# EAGLE design BESt-module_v.1.2_big (EAGLE 9.6.2)

## Sheet 1 of 2
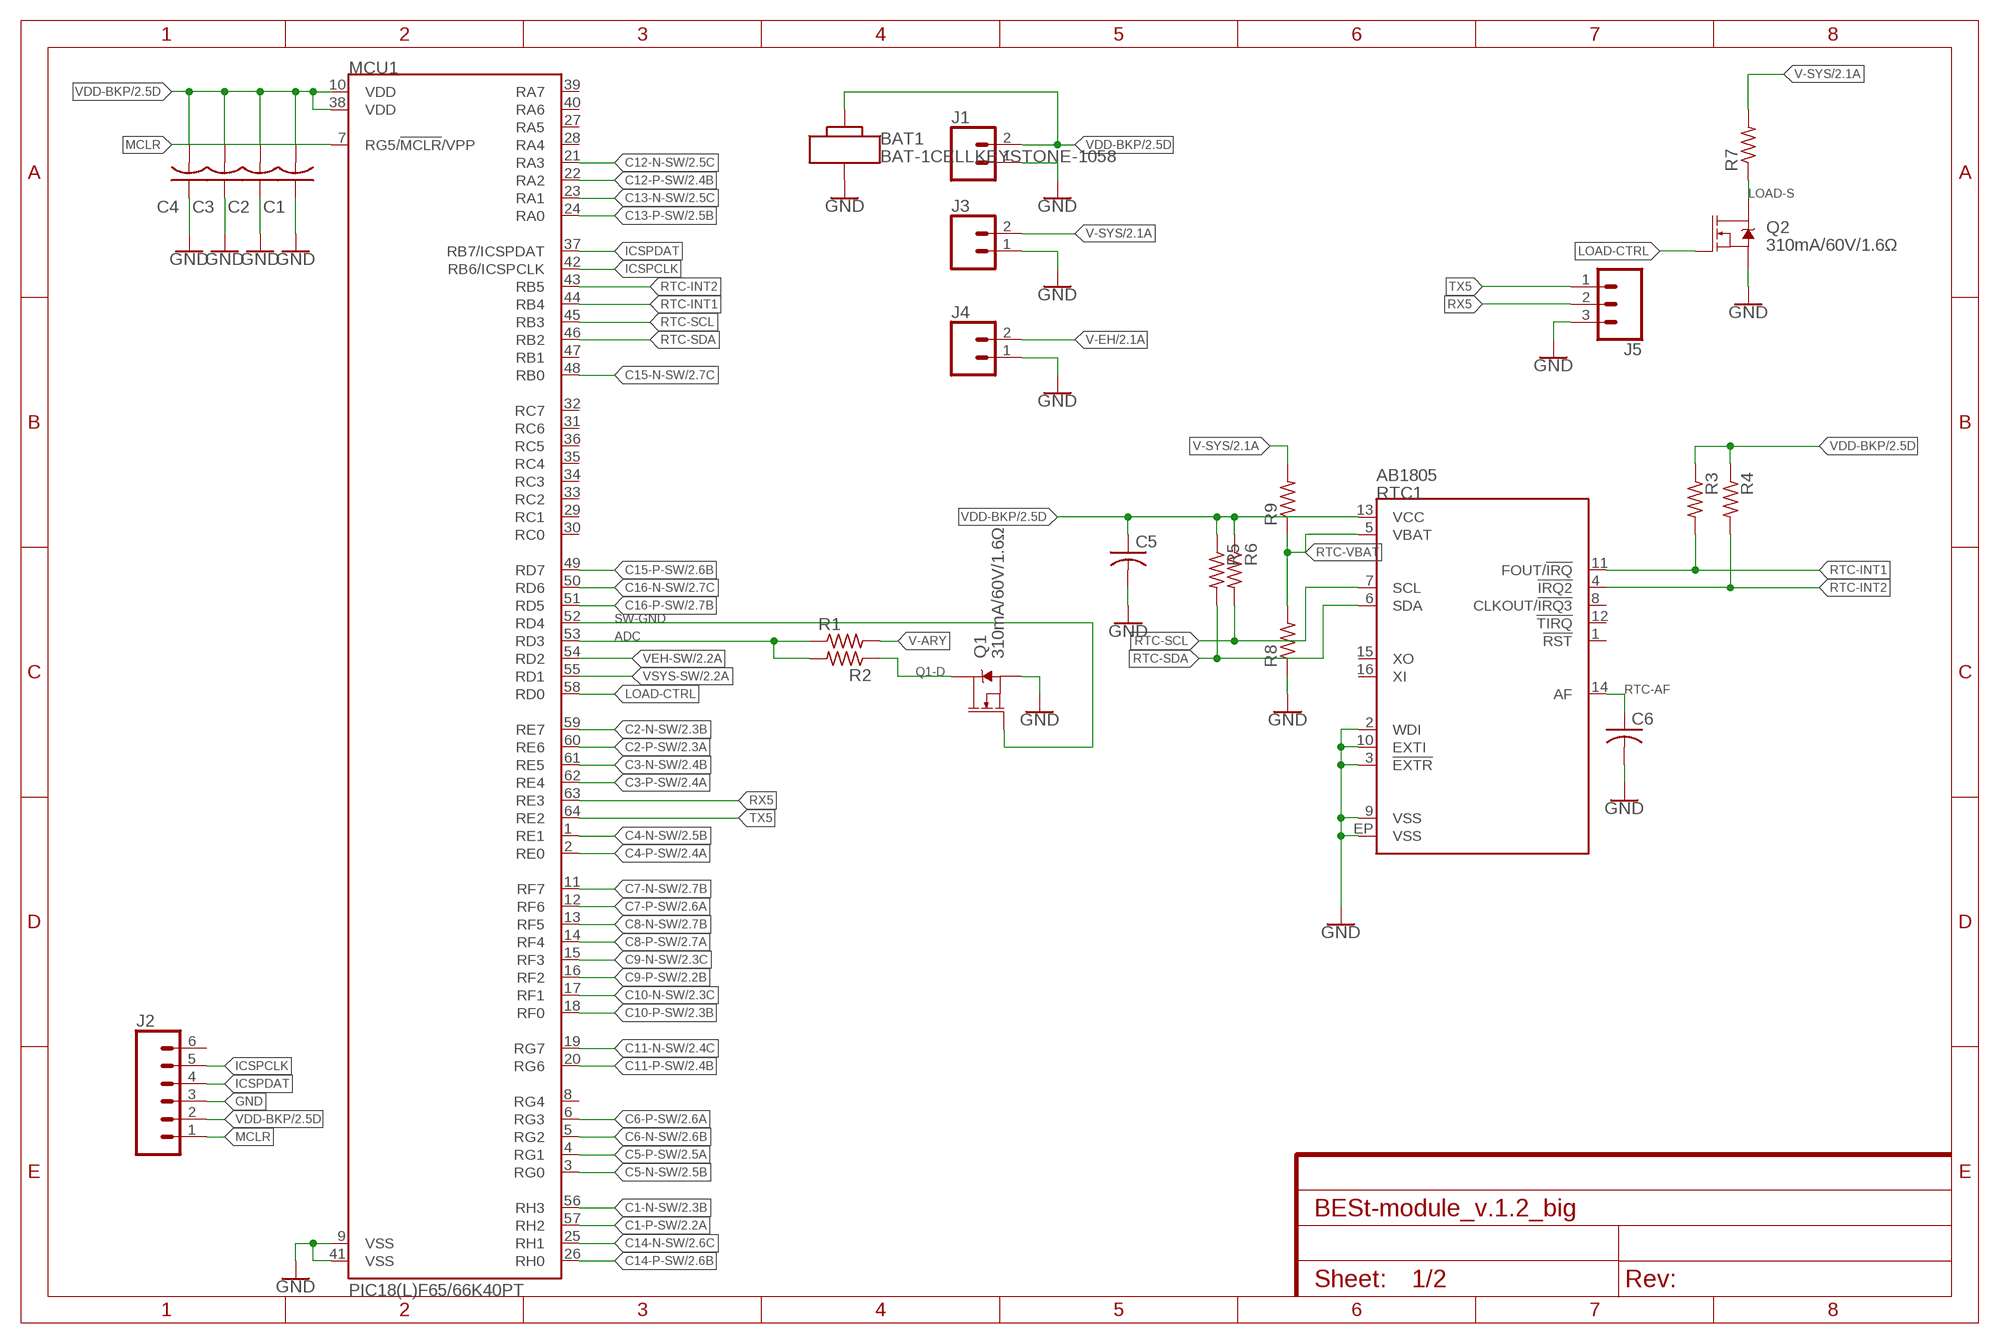
[diagram p0: schematic, sheet 1]

### Parts
BAT1  BAT-1CELLKEYSTONE-1058  [KEYSTONE-1058]
C1  0.1uF  C-USC0603  [C0603]
C2  0.1uF  C-USC0603  [C0603]
C3  0.1uF  C-USC0603  [C0603]
C4  0.1uF  C-USC0603  [C0603]
C5  C-USC0603  [C0603]
C6  C-USC0603  [C0603]
J1  CONN_02  [1X02]
J2  CONN_06NO_SILK_NO_POP  [1X06_NO_SILK]
J3  CONN_025MM  [SCREWTERMINAL-5MM-2]
J4  CONN_025MM  [SCREWTERMINAL-5MM-2]
J5  CONN_03  [1X03]
MCU1  PIC18(L)F65/66K40PT  [QFP50P1200X1200X120-64N]
Q1  310mA/60V/1.6Ω  MOSFET-NCH-2N7002PW  [SOT323]
Q2  310mA/60V/1.6Ω  MOSFET-NCH-2N7002PW  [SOT323]
R1  R-US_R0603  [R0603]
R2  R-US_R0603  [R0603]
R3  R-US_R0603  [R0603]
R4  R-US_R0603  [R0603]
R5  R-US_R0603  [R0603]
R6  R-US_R0603  [R0603]
R7  R-US_R0805  [R0805]
R8  R-US_R0603  [R0603]
R9  R-US_R0603  [R0603]
RTC1  AB1805  [QFN-16-3X3]

### Nets
ADC: MCU1.53(RD3) R1.1 R2.2
C1-N-SW: MCU1.56(RH3) ; also sheet 2
C1-P-SW: MCU1.57(RH2) ; also sheet 2
C2-N-SW: MCU1.59(RE7) ; also sheet 2
C2-P-SW: MCU1.60(RE6) ; also sheet 2
C3-N-SW: MCU1.61(RE5) ; also sheet 2
C3-P-SW: MCU1.62(RE4) ; also sheet 2
C4-N-SW: MCU1.1(RE1) ; also sheet 2
C4-P-SW: MCU1.2(RE0) ; also sheet 2
C5-N-SW: MCU1.3(RG0) ; also sheet 2
C5-P-SW: MCU1.4(RG1) ; also sheet 2
C6-N-SW: MCU1.5(RG2) ; also sheet 2
C6-P-SW: MCU1.6(RG3) ; also sheet 2
C7-N-SW: MCU1.11(RF7) ; also sheet 2
C7-P-SW: MCU1.12(RF6) ; also sheet 2
C8-N-SW: MCU1.13(RF5) ; also sheet 2
C8-P-SW: MCU1.14(RF4) ; also sheet 2
C9-N-SW: MCU1.15(RF3) ; also sheet 2
C9-P-SW: MCU1.16(RF2) ; also sheet 2
C10-N-SW: MCU1.17(RF1) ; also sheet 2
C10-P-SW: MCU1.18(RF0) ; also sheet 2
C11-N-SW: MCU1.19(RG7) ; also sheet 2
C11-P-SW: MCU1.20(RG6) ; also sheet 2
C12-N-SW: MCU1.21(RA3) ; also sheet 2
C12-P-SW: MCU1.22(RA2) ; also sheet 2
C13-N-SW: MCU1.23(RA1) ; also sheet 2
C13-P-SW: MCU1.24(RA0) ; also sheet 2
C14-N-SW: MCU1.25(RH1) ; also sheet 2
C14-P-SW: MCU1.26(RH0) ; also sheet 2
C15-N-SW: MCU1.48(RB0) ; also sheet 2
C15-P-SW: MCU1.49(RD7) ; also sheet 2
C16-N-SW: MCU1.50(RD6) ; also sheet 2
C16-P-SW: MCU1.51(RD5) ; also sheet 2
GND: BAT1.N C1.1 C2.1 C3.1 C4.1 C5.2 C6.2 J1.1 J2.3 J3.1 J4.1 J5.3 MCU1.9(VSS) MCU1.41(VSS) Q1.2(S) Q2.2(S) R8.1 RTC1.2(WDI) RTC1.3(!EXTR) RTC1.9(VSS) RTC1.10(EXTI) RTC1.EP(VSS) ; also sheet 2
ICSPCLK: J2.5 MCU1.42(RB6/ICSPCLK)
ICSPDAT: J2.4 MCU1.37(RB7/ICSPDAT)
LOAD-CTRL: MCU1.58(RD0) Q2.1(G)
LOAD-S: Q2.3(D) R7.1
MCLR: J2.1 MCU1.7(RG5/!MCLR!/VPP)
Q1-D: Q1.3(D) R2.1
RTC-AF: C6.1 RTC1.14(AF)
RTC-INT1: MCU1.44(RB4) R3.2 RTC1.11(FOUT/!IRQ)
RTC-INT2: MCU1.43(RB5) R4.2 RTC1.4(!IRQ2)
RTC-SCL: MCU1.45(RB3) R6.2 RTC1.7(SCL)
RTC-SDA: MCU1.46(RB2) R5.2 RTC1.6(SDA)
RTC-VBAT: R8.2 R9.1 RTC1.5(VBAT)
RX5: J5.2 MCU1.63(RE3)
SW-GND: MCU1.52(RD4) Q1.1(G)
TX5: J5.1 MCU1.64(RE2)
V-ARY: R1.2 ; also sheet 2
V-EH: J4.2 ; also sheet 2
V-SYS: J3.2 R7.2 R9.2 ; also sheet 2
VDD-BKP: BAT1.P C1.2 C2.2 C3.2 C4.2 C5.1 J1.2 J2.2 MCU1.10(VDD) MCU1.38(VDD) R3.1 R4.1 R5.1 R6.1 RTC1.13(VCC) ; also sheet 2
VEH-SW: MCU1.54(RD2) ; also sheet 2
VSYS-SW: MCU1.55(RD1) ; also sheet 2
Unconnected: J2.6 MCU1.8(RG4) MCU1.27(RA5) MCU1.28(RA4) MCU1.29(RC1) MCU1.30(RC0) MCU1.31(RC6) MCU1.32(RC7) MCU1.33(RC2) MCU1.34(RC3) MCU1.35(RC4) MCU1.36(RC5) MCU1.39(RA7) MCU1.40(RA6) MCU1.47(RB1) RTC1.1(!RST) RTC1.8(CLKOUT/!IRQ3) RTC1.12(!TIRQ) RTC1.15(XO) RTC1.16(XI)

## Sheet 2 of 2
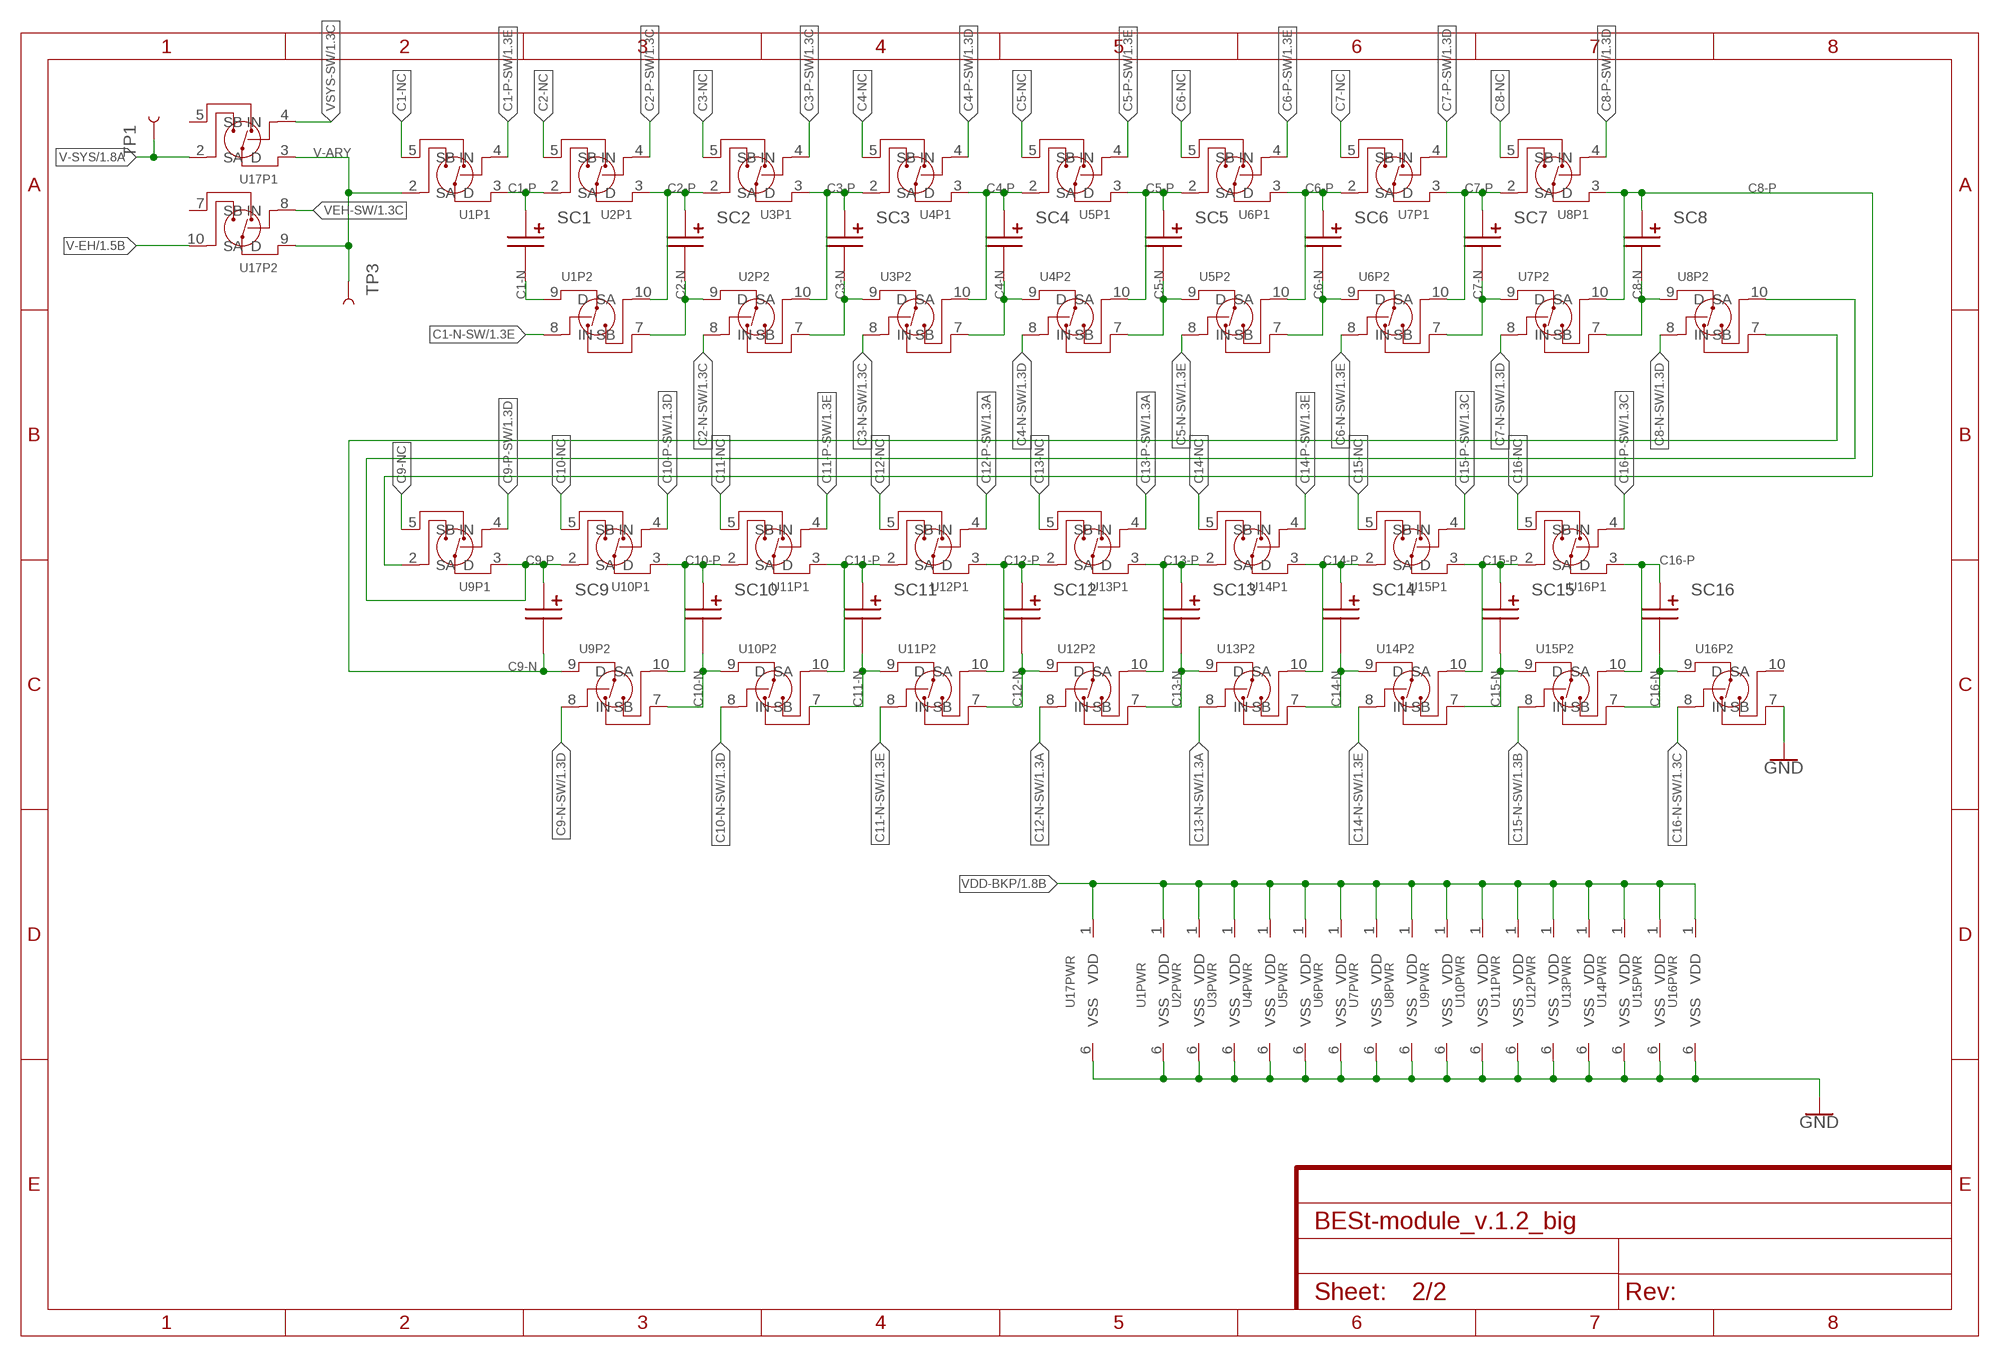
[diagram p1: schematic, sheet 2]

### Parts
SC1  PM-5R0H/V104-R-VER  [EATON-13X11.3X6-V]
SC2  PM-5R0H/V104-R-VER  [EATON-13X11.3X6-V]
SC3  PM-5R0H/V104-R-VER  [EATON-13X11.3X6-V]
SC4  PM-5R0H/V104-R-VER  [EATON-13X11.3X6-V]
SC5  PM-5R0H/V104-R-VER  [EATON-13X11.3X6-V]
SC6  PM-5R0H/V104-R-VER  [EATON-13X11.3X6-V]
SC7  PM-5R0H/V104-R-VER  [EATON-13X11.3X6-V]
SC8  PM-5R0H/V104-R-VER  [EATON-13X11.3X6-V]
SC9  PM-5R0H/V104-R-VER  [EATON-13X11.3X6-V]
SC10  PM-5R0H/V104-R-VER  [EATON-13X11.3X6-V]
SC11  PM-5R0H/V104-R-VER  [EATON-13X11.3X6-V]
SC12  PM-5R0H/V104-R-VER  [EATON-13X11.3X6-V]
SC13  PM-5R0H/V104-R-VER  [EATON-13X11.3X6-V]
SC14  PM-5R0H/V104-R-VER  [EATON-13X11.3X6-V]
SC15  PM-5R0H/V104-R-VER  [EATON-13X11.3X6-V]
SC16  PM-5R0H/V104-R-VER  [EATON-13X11.3X6-V]
TP1  TEST-POINT3X4  [PAD.03X.04]
TP3  TEST-POINT3X4  [PAD.03X.04]
U1  DG2535EDQ  [SOP50P490X110-10N]
U2  DG2535EDQ  [SOP50P490X110-10N]
U3  DG2535EDQ  [SOP50P490X110-10N]
U4  DG2535EDQ  [SOP50P490X110-10N]
U5  DG2535EDQ  [SOP50P490X110-10N]
U6  DG2535EDQ  [SOP50P490X110-10N]
U7  DG2535EDQ  [SOP50P490X110-10N]
U8  DG2535EDQ  [SOP50P490X110-10N]
U9  DG2535EDQ  [SOP50P490X110-10N]
U10  DG2535EDQ  [SOP50P490X110-10N]
U11  DG2535EDQ  [SOP50P490X110-10N]
U12  DG2535EDQ  [SOP50P490X110-10N]
U13  DG2535EDQ  [SOP50P490X110-10N]
U14  DG2535EDQ  [SOP50P490X110-10N]
U15  DG2535EDQ  [SOP50P490X110-10N]
U16  DG2535EDQ  [SOP50P490X110-10N]
U17  DG2535EDQ  [SOP50P490X110-10N]

### Nets
C1-N: SC1.N U1.9(P2:D)
C1-N-SW: U1.8(P2:IN) ; also sheet 1
C1-NC: U1.5(P1:SB)
C1-P: SC1.P U1.3(P1:D) U2.2(P1:SA)
C1-P-SW: U1.4(P1:IN) ; also sheet 1
C2-N: SC2.N U1.7(P2:SB) U2.9(P2:D)
C2-N-SW: U2.8(P2:IN) ; also sheet 1
C2-NC: U2.5(P1:SB)
C2-P: SC2.P U1.10(P2:SA) U2.3(P1:D) U3.2(P1:SA)
C2-P-SW: U2.4(P1:IN) ; also sheet 1
C3-N: SC3.N U2.7(P2:SB) U3.9(P2:D)
C3-N-SW: U3.8(P2:IN) ; also sheet 1
C3-NC: U3.5(P1:SB)
C3-P: SC3.P U2.10(P2:SA) U3.3(P1:D) U4.2(P1:SA)
C3-P-SW: U3.4(P1:IN) ; also sheet 1
C4-N: SC4.N U3.7(P2:SB) U4.9(P2:D)
C4-N-SW: U4.8(P2:IN) ; also sheet 1
C4-NC: U4.5(P1:SB)
C4-P: SC4.P U3.10(P2:SA) U4.3(P1:D) U5.2(P1:SA)
C4-P-SW: U4.4(P1:IN) ; also sheet 1
C5-N: SC5.N U4.7(P2:SB) U5.9(P2:D)
C5-N-SW: U5.8(P2:IN) ; also sheet 1
C5-NC: U5.5(P1:SB)
C5-P: SC5.P U4.10(P2:SA) U5.3(P1:D) U6.2(P1:SA)
C5-P-SW: U5.4(P1:IN) ; also sheet 1
C6-N: SC6.N U5.7(P2:SB) U6.9(P2:D)
C6-N-SW: U6.8(P2:IN) ; also sheet 1
C6-NC: U6.5(P1:SB)
C6-P: SC6.P U5.10(P2:SA) U6.3(P1:D) U7.2(P1:SA)
C6-P-SW: U6.4(P1:IN) ; also sheet 1
C7-N: SC7.N U6.7(P2:SB) U7.9(P2:D)
C7-N-SW: U7.8(P2:IN) ; also sheet 1
C7-NC: U7.5(P1:SB)
C7-P: SC7.P U6.10(P2:SA) U7.3(P1:D) U8.2(P1:SA)
C7-P-SW: U7.4(P1:IN) ; also sheet 1
C8-N: SC8.N U7.7(P2:SB) U8.9(P2:D)
C8-N-SW: U8.8(P2:IN) ; also sheet 1
C8-NC: U8.5(P1:SB)
C8-P: SC8.P U7.10(P2:SA) U8.3(P1:D) U9.2(P1:SA)
C8-P-SW: U8.4(P1:IN) ; also sheet 1
C9-N: SC9.N U8.7(P2:SB) U9.9(P2:D)
C9-N-SW: U9.8(P2:IN) ; also sheet 1
C9-NC: U9.5(P1:SB)
C9-P: SC9.P U8.10(P2:SA) U9.3(P1:D) U10.2(P1:SA)
C9-P-SW: U9.4(P1:IN) ; also sheet 1
C10-N: SC10.N U9.7(P2:SB) U10.9(P2:D)
C10-N-SW: U10.8(P2:IN) ; also sheet 1
C10-NC: U10.5(P1:SB)
C10-P: SC10.P U9.10(P2:SA) U10.3(P1:D) U11.2(P1:SA)
C10-P-SW: U10.4(P1:IN) ; also sheet 1
C11-N: SC11.N U10.7(P2:SB) U11.9(P2:D)
C11-N-SW: U11.8(P2:IN) ; also sheet 1
C11-NC: U11.5(P1:SB)
C11-P: SC11.P U10.10(P2:SA) U11.3(P1:D) U12.2(P1:SA)
C11-P-SW: U11.4(P1:IN) ; also sheet 1
C12-N: SC12.N U11.7(P2:SB) U12.9(P2:D)
C12-N-SW: U12.8(P2:IN) ; also sheet 1
C12-NC: U12.5(P1:SB)
C12-P: SC12.P U11.10(P2:SA) U12.3(P1:D) U13.2(P1:SA)
C12-P-SW: U12.4(P1:IN) ; also sheet 1
C13-N: SC13.N U12.7(P2:SB) U13.9(P2:D)
C13-N-SW: U13.8(P2:IN) ; also sheet 1
C13-NC: U13.5(P1:SB)
C13-P: SC13.P U12.10(P2:SA) U13.3(P1:D) U14.2(P1:SA)
C13-P-SW: U13.4(P1:IN) ; also sheet 1
C14-N: SC14.N U13.7(P2:SB) U14.9(P2:D)
C14-N-SW: U14.8(P2:IN) ; also sheet 1
C14-NC: U14.5(P1:SB)
C14-P: SC14.P U13.10(P2:SA) U14.3(P1:D) U15.2(P1:SA)
C14-P-SW: U14.4(P1:IN) ; also sheet 1
C15-N: SC15.N U14.7(P2:SB) U15.9(P2:D)
C15-N-SW: U15.8(P2:IN) ; also sheet 1
C15-NC: U15.5(P1:SB)
C15-P: SC15.P U14.10(P2:SA) U15.3(P1:D) U16.2(P1:SA)
C15-P-SW: U15.4(P1:IN) ; also sheet 1
C16-N: SC16.N U15.7(P2:SB) U16.9(P2:D)
C16-N-SW: U16.8(P2:IN) ; also sheet 1
C16-NC: U16.5(P1:SB)
C16-P: SC16.P U15.10(P2:SA) U16.3(P1:D)
C16-P-SW: U16.4(P1:IN) ; also sheet 1
GND: U1.6(PWR:VSS) U2.6(PWR:VSS) U3.6(PWR:VSS) U4.6(PWR:VSS) U5.6(PWR:VSS) U6.6(PWR:VSS) U7.6(PWR:VSS) U8.6(PWR:VSS) U9.6(PWR:VSS) U10.6(PWR:VSS) U11.6(PWR:VSS) U12.6(PWR:VSS) U13.6(PWR:VSS) U14.6(PWR:VSS) U15.6(PWR:VSS) U16.6(PWR:VSS) U16.7(P2:SB) U17.6(PWR:VSS) ; also sheet 1
V-ARY: TP3.P$1 U1.2(P1:SA) U17.3(P1:D) U17.9(P2:D) ; also sheet 1
V-EH: U17.10(P2:SA) ; also sheet 1
V-SYS: TP1.P$1 U17.2(P1:SA) ; also sheet 1
VDD-BKP: U1.1(PWR:VDD) U2.1(PWR:VDD) U3.1(PWR:VDD) U4.1(PWR:VDD) U5.1(PWR:VDD) U6.1(PWR:VDD) U7.1(PWR:VDD) U8.1(PWR:VDD) U9.1(PWR:VDD) U10.1(PWR:VDD) U11.1(PWR:VDD) U12.1(PWR:VDD) U13.1(PWR:VDD) U14.1(PWR:VDD) U15.1(PWR:VDD) U16.1(PWR:VDD) U17.1(PWR:VDD) ; also sheet 1
VEH-SW: U17.8(P2:IN) ; also sheet 1
VSYS-SW: U17.4(P1:IN) ; also sheet 1
Unconnected: U16.10(P2:SA) U17.5(P1:SB) U17.7(P2:SB)

## Library data of the parts
BAT1 = Fan_Battery_Holder:BAT-1CELL
C1-C6 = rcl:C-US: CAPACITOR, American symbol; SPICEPREFIX: C
J1 = SparkFun-Connectors:CONN_02: Multi connection point. Often used as Generic Header-pin footprint for 0.1 inch spaced/style header connections On any of the 0.1 inch spaced packages, you can populate with these: Break Away Headers - Straight <https://www.sparkfun.com/products/116> (PRT-00116) Break Away Male Headers - Right Angle <https://www.sparkfun.com/products/553> (PRT-00553) Female Headers <https://www.sparkfun.com/products/115> (PRT-00115) Break Away Headers - Machine Pin <https://www.sparkfun.com/products/117> (PRT-00117) Break Away Female Headers - Swiss Machine Pin <https://www.sparkfun.com/products/743> (PRT-00743) For SCREWTERMINALS and SPRING TERMINALS visit here: Screw Terimnals on SparkFun.com <https://www.sparkfun.com/search/results?term=Screw+Terminals> (5mm/3.5mm/2.54mm spacing) This device is also useful as a general connection point to wire up your design to another part of your project. Our various solder wires solder well into these plated through hole pads. Hook-Up Wire - Assortment (Stranded, 22 AWG) <https://www.sparkfun.com/products/11375> (PRT-11375) Hook-Up Wire - Assortment (Solid Core, 22 AWG) <https://www.sparkfun.com/products/11367> (PRT-11367) View the entire wire category on our website here <https://www.sparkfun.com/categories/141> Special notes: Molex polarized connector foot print use with: PRT-08233 with associated crimp pins and housings. 2.54_SCREWTERM for use with PRT-10571. 3.5mm Screw Terminal footprints for PRT-08084 5mm Screw Terminal footprints for use with PRT-08432
J2 = SparkFun-Connectors:CONN_06: Multi connection point. Often used as Generic Header-pin footprint for 0.1 inch spaced/style header connections On any of the 0.1 inch spaced packages, you can populate with these: Break Away Headers - Straight <https://www.sparkfun.com/products/116> (PRT-00116) Break Away Male Headers - Right Angle <https://www.sparkfun.com/products/553> (PRT-00553) Female Headers <https://www.sparkfun.com/products/115> (PRT-00115) Break Away Headers - Machine Pin <https://www.sparkfun.com/products/117> (PRT-00117) Break Away Female Headers - Swiss Machine Pin <https://www.sparkfun.com/products/743> (PRT-00743) Arduino Stackable Header - 6 Pin <https://www.sparkfun.com/products/9280> (PRT-09280) For SCREWTERMINALS and SPRING TERMINALS visit here: Screw Terimnals on SparkFun.com <https://www.sparkfun.com/search/results?term=Screw+Terminals> (5mm/3.5mm/2.54mm spacing) This device is also useful as a general connection point to wire up your design to another part of your project. Our various solder wires solder well into these plated through hole pads. Hook-Up Wire - Assortment (Stranded, 22 AWG) <https://www.sparkfun.com/products/11375> (PRT-11375) Hook-Up Wire - Assortment (Solid Core, 22 AWG) <https://www.sparkfun.com/products/11367> (PRT-11367) View the entire wire category on our website here <https://www.sparkfun.com/categories/141>
J3 J4 = SparkFun-Connectors:CONN_02: Multi connection point. Often used as Generic Header-pin footprint for 0.1 inch spaced/style header connections On any of the 0.1 inch spaced packages, you can populate with these: Break Away Headers - Straight <https://www.sparkfun.com/products/116> (PRT-00116) Break Away Male Headers - Right Angle <https://www.sparkfun.com/products/553> (PRT-00553) Female Headers <https://www.sparkfun.com/products/115> (PRT-00115) Break Away Headers - Machine Pin <https://www.sparkfun.com/products/117> (PRT-00117) Break Away Female Headers - Swiss Machine Pin <https://www.sparkfun.com/products/743> (PRT-00743) For SCREWTERMINALS and SPRING TERMINALS visit here: Screw Terimnals on SparkFun.com <https://www.sparkfun.com/search/results?term=Screw+Terminals> (5mm/3.5mm/2.54mm spacing) This device is also useful as a general connection point to wire up your design to another part of your project. Our various solder wires solder well into these plated through hole pads. Hook-Up Wire - Assortment (Stranded, 22 AWG) <https://www.sparkfun.com/products/11375> (PRT-11375) Hook-Up Wire - Assortment (Solid Core, 22 AWG) <https://www.sparkfun.com/products/11367> (PRT-11367) View the entire wire category on our website here <https://www.sparkfun.com/categories/141> Special notes: Molex polarized connector foot print use with: PRT-08233 with associated crimp pins and housings. 2.54_SCREWTERM for use with PRT-10571. 3.5mm Screw Terminal footprints for PRT-08084 5mm Screw Terminal footprints for use with PRT-08432; SF_SKU: PRT-08432
J5 = SparkFun-Connectors:CONN_03: Multi connection point. Often used as Generic Header-pin footprint for 0.1 inch spaced/style header connections On any of the 0.1 inch spaced packages, you can populate with these: Break Away Headers - Straight <https://www.sparkfun.com/products/116> (PRT-00116) Break Away Male Headers - Right Angle <https://www.sparkfun.com/products/553> (PRT-00553) Female Headers <https://www.sparkfun.com/products/115> (PRT-00115) Break Away Headers - Machine Pin <https://www.sparkfun.com/products/117> (PRT-00117) Break Away Female Headers - Swiss Machine Pin <https://www.sparkfun.com/products/743> (PRT-00743) Stackable Header - 3 Pin (Female, 0.1") <https://www.sparkfun.com/products/13875> (PRT-13875) For SCREWTERMINALS and SPRING TERMINALS visit here: Screw Terimnals on SparkFun.com <https://www.sparkfun.com/search/results?term=Screw+Terminals> (5mm/3.5mm/2.54mm spacing) This device is also useful as a general connection point to wire up your design to another part of your project. Our various solder wires solder well into these plated through hole pads. Hook-Up Wire - Assortment (Stranded, 22 AWG) <https://www.sparkfun.com/products/11375> (PRT-11375) Hook-Up Wire - Assortment (Solid Core, 22 AWG) <https://www.sparkfun.com/products/11367> (PRT-11367) View the entire wire category on our website here <https://www.sparkfun.com/categories/141> Special notes: Molex polarized connector foot print use with SKU : PRT-08232 with associated crimp pins and housings.
MCU1 = Fan_PIC_MCU:PIC18(L)F65/66K40: 64-Pin, Low-Power, High-Performance Microcontrollers with XLP Technology
Q1 Q2 = SparkFun-DiscreteSemi:MOSFET-NCH: N-channel MOSFETs Voltage controlled devices that allow control of high current outputs. SparkFun Products: SparkFun OpenScale <https://www.sparkfun.com/products/13261> SparkFun Digital Sandbox <https://www.sparkfun.com/products/12651> SparkFun Monster Moto Shield <https://www.sparkfun.com/products/10182> SparkFun MOSFET Power Controller <https://www.sparkfun.com/products/11214>; PROD_ID: TRANS-11151
R1-R9 = rcl:R-US_: RESISTOR, American symbol; SPICEPREFIX: R
RTC1 = Fan_RTC:AB1805
SC1-SC16 = Fan_SuperCap:PM-5R0H/V104-R: CAP 100MF -20% +80% 5V T/H
TP1 TP3 = SparkFun-Connectors:TEST-POINT: SparkFun Test Points Bare copper test points for troubleshooting or In-Circuit-Testing. These are used by our Production team for verifying production board runs using pogo-pins on test beds. SparkFun Products: SparkFun LSM9DS1 Breakout <https://www.sparkfun.com/products/13284> SparkFun PSOC <https://www.sparkfun.com/products/13714> SparkFun Load Cell Amplifier <https://www.sparkfun.com/products/13879>
U1-U17 = Fan_AnalogMUX:DG2535E: IC ANALOG SWITCH DUAL

## Board
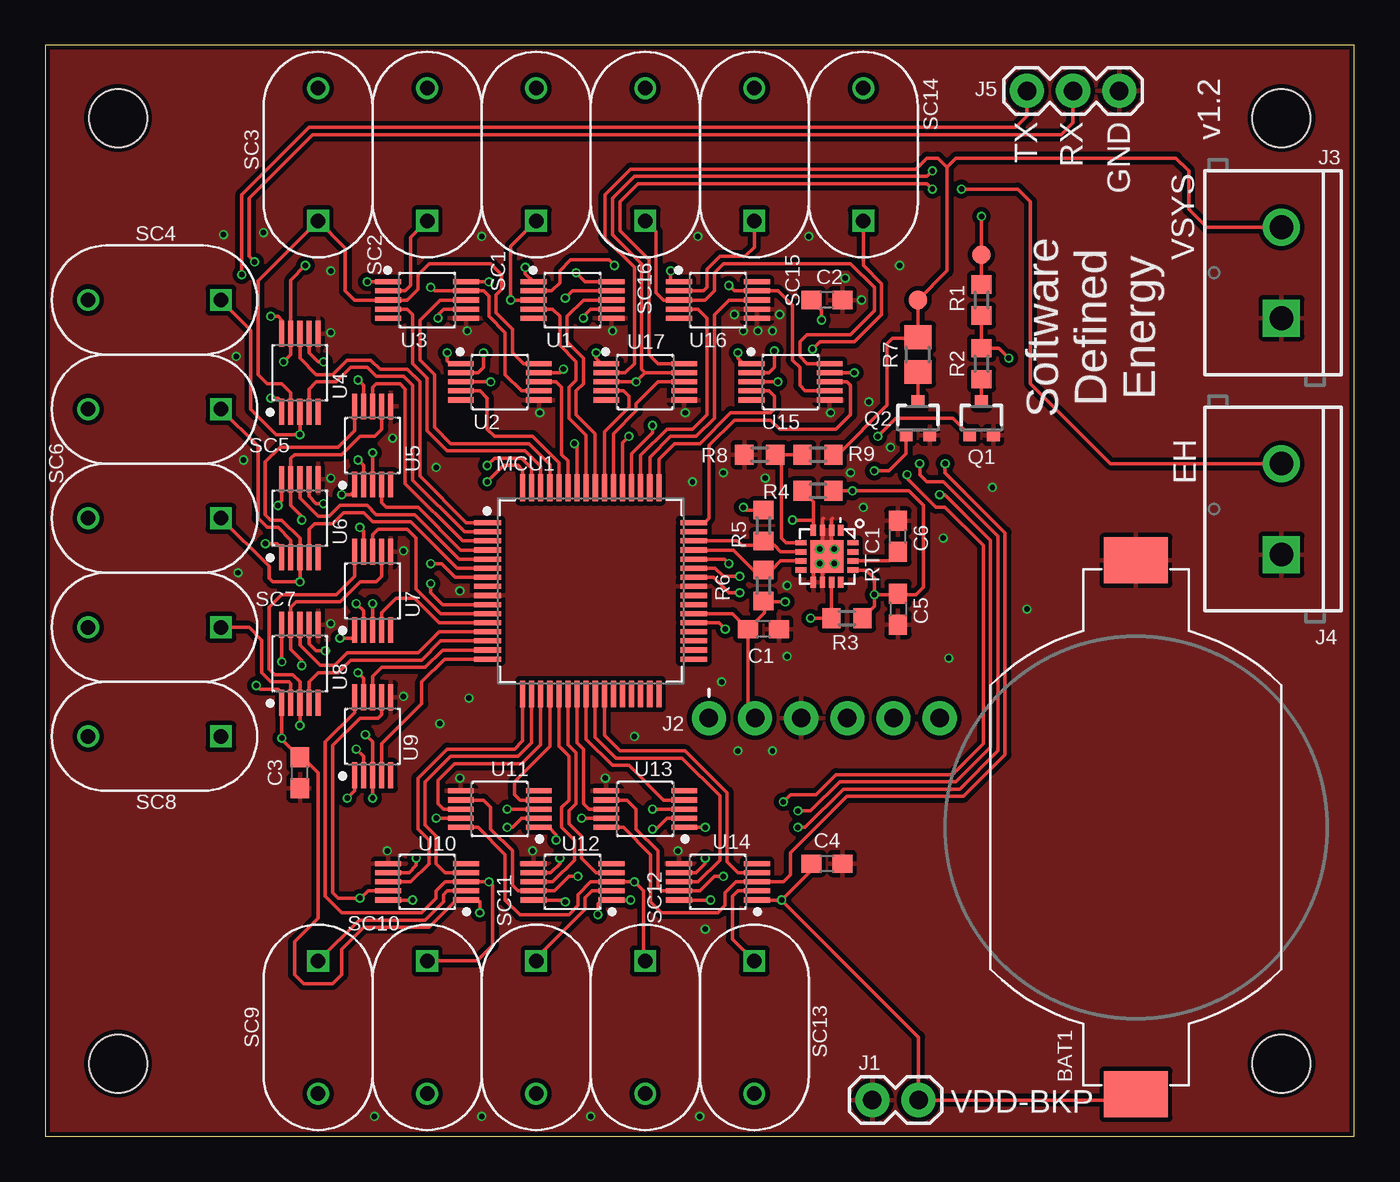
[diagram p2: board, top side]
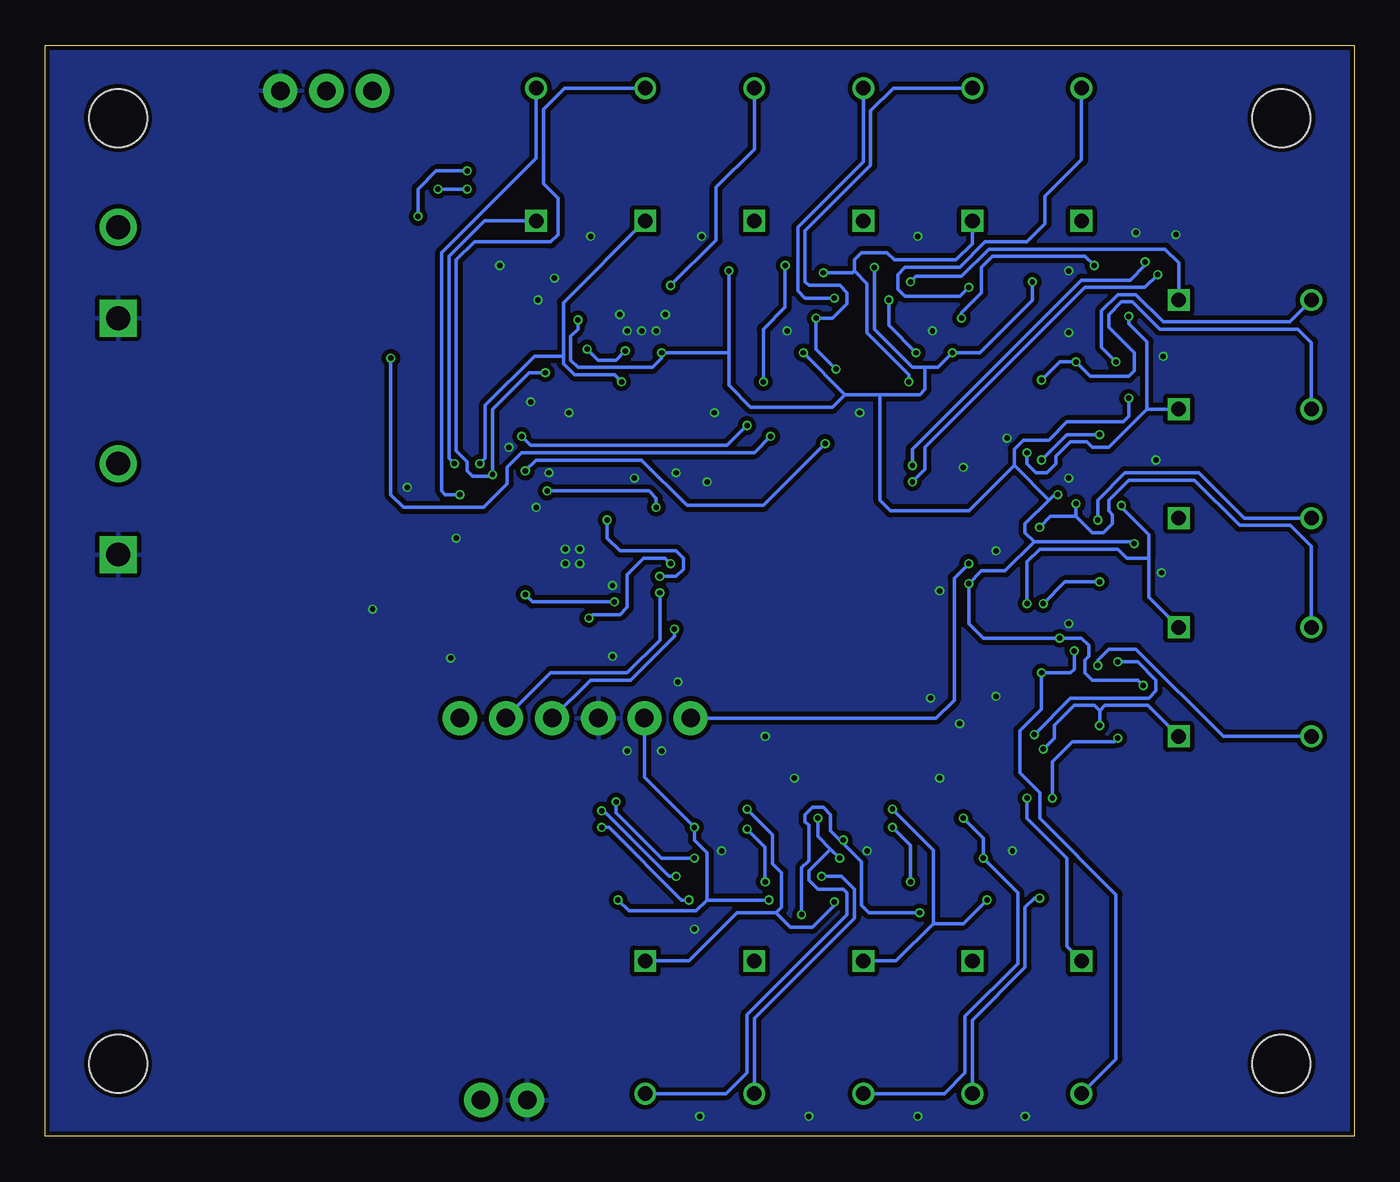
[diagram p3: board, bottom side, seen from below]

Size 72 x 60 mm. Coordinates in mm from the lower left corner, seen from the top.
Outline: 0,0 72,0 72,60 0,60 0,0
Copper layers (1*16): Top 0.035mm / dielectric 1.5mm / Bottom 0.035mm
Design rules "default *": minimum track width 0.2mm, minimum drill 0.3mm, track to track 0.2mm, track to pad 0.2mm, pad to pad 0.2mm, via to via 0.2mm, smd to smd 0mil, copper to edge 0.2mm, drill to drill 0.2mm, minimum pad ring 0.2mm, minimum via ring 0.1mm, stop-mask expansion 4mil, vias tented up to drill 0mil, thermal gap 10mil
Holes 3.2 mm at 4,4 4,56 68,4 68,56

### Footprints (pad centres in the part's own frame; a part is rotated, then mirrored left to right if it is on the bottom)
KEYSTONE-1058 = smd 2.54 x 3.51: N 14.68,0; P -14.68,0
C0603 = smd 1.1 x 1: 1 -0.85,0; 2 0.85,0
1X02 = drill 1.016 pad 1.88: 1 0,0; 2 2.54,0
1X06_NO_SILK = drill 1.016 pad 1.88: 1 0,0; 2 2.54,0; 3 5.08,0; 4 7.62,0; 5 10.16,0; 6 12.7,0
SCREWTERMINAL-5MM-2 = drill 1.3 pad 2.032 square: 1 0,0 | drill 1.3 pad 2.032: 2 5,0
1X03 = drill 1.016 pad 1.88: 1 0,0; 2 2.54,0; 3 5.08,0
QFP50P1200X1200X120-64N = smd 1.469 x 0.28: 1 -5.671,3.75; 2 -5.671,3.25; 3 -5.671,2.75; 4 -5.671,2.25; 5 -5.671,1.75; 6 -5.671,1.25; 7 -5.671,0.75; 8 -5.671,0.25; 9 -5.671,-0.25; 10 -5.671,-0.75; 11 -5.671,-1.25; 12 -5.671,-1.75; 13 -5.671,-2.25; 14 -5.671,-2.75; 15 -5.671,-3.25; 16 -5.671,-3.75; 33 5.671,-3.75; 34 5.671,-3.25; 35 5.671,-2.75; 36 5.671,-2.25; 37 5.671,-1.75; 38 5.671,-1.25; 39 5.671,-0.75; 40 5.671,-0.25; 41 5.671,0.25; 42 5.671,0.75; 43 5.671,1.25; 44 5.671,1.75; 45 5.671,2.25; 46 5.671,2.75; 47 5.671,3.25; 48 5.671,3.75 | smd 0.28 x 1.469: 17 -3.75,-5.671; 18 -3.25,-5.671; 19 -2.75,-5.671; 20 -2.25,-5.671; 21 -1.75,-5.671; 22 -1.25,-5.671; 23 -0.75,-5.671; 24 -0.25,-5.671; 25 0.25,-5.671; 26 0.75,-5.671; 27 1.25,-5.671; 28 1.75,-5.671; 29 2.25,-5.671; 30 2.75,-5.671; 31 3.25,-5.671; 32 3.75,-5.671; 49 3.75,5.671; 50 3.25,5.671; 51 2.75,5.671; 52 2.25,5.671; 53 1.75,5.671; 54 1.25,5.671; 55 0.75,5.671; 56 0.25,5.671; 57 -0.25,5.671; 58 -0.75,5.671; 59 -1.25,5.671; 60 -1.75,5.671; 61 -2.25,5.671; 62 -2.75,5.671; 63 -3.25,5.671; 64 -3.75,5.671
SOT323 = smd 0.7 x 0.7: 1 -0.65,-0.925; 2 0.65,-0.925; 3 0,0.925
R0603 = smd 1 x 1.1: 1 -0.85,0; 2 0.85,0
R0805 = smd 1.3 x 1.5: 1 -0.95,0; 2 0.95,0
QFN-16-3X3 = smd 0.6 x 0.3: 1 -1.43,0.75; 2 -1.43,0.25; 3 -1.43,-0.25; 4 -1.43,-0.75; 9 1.43,-0.75; 10 1.43,-0.25; 11 1.43,0.25; 12 1.43,0.75 | smd 0.3 x 0.6: 5 -0.75,-1.43; 6 -0.25,-1.43; 7 0.25,-1.43; 8 0.75,-1.43; 13 0.75,1.43; 14 0.25,1.43; 15 -0.25,1.43; 16 -0.75,1.43 | smd 1.8 x 1.8: EP 0,0
EATON-13X11.3X6-V = drill 0.8: N 0,3.65 | drill 0.8 square: P 0,-3.65
PAD.03X.04 = smd 1.016 x 1.016: P$1 0,0
SOP50P490X110-10N = smd 1.419 x 0.28: 1 -2.146,1; 2 -2.146,0.5; 3 -2.146,0; 4 -2.146,-0.5; 5 -2.146,-1; 6 2.146,-1; 7 2.146,-0.5; 8 2.146,0; 9 2.146,0.5; 10 2.146,1

### Placement (x,y rotation side)
BAT1  60,17 90 top
C1  39.5,27.9 180 top
C2  43,46 180 top
C3  14,20 90 top
C4  43,15 180 top
C5  46.9,29 270 top
C6  46.9,33 90 top
J1  45.5,2 0 top
J2  36.5,23 0 top
J3  68,45 90 top
J4  68,32 90 top
J5  54,57.5 0 top
MCU1  30,30 0 top
Q1  51.5,39.5 0 top
Q2  48,39.5 0 top
R1  51.5,46 90 top
R2  51.5,42.5 90 top
R3  44.1,28.5 180 top
R4  42.5,35.5 180 top
R5  39.5,33.6 270 top
R6  39.5,30.3 90 top
R7  48,43 90 top
R8  39.3,37.5 0 top
R9  42.5,37.5 0 top
RTC1  43,31.9 270 top
SC1  27,54 0 top
SC2  21,54 0 top
SC3  15,54 0 top
SC4  6,46 90 top
SC5  6,40 90 top
SC6  6,34 90 top
SC7  6,28 90 top
SC8  6,22 90 top
SC9  15,6 180 top
SC10  21,6 180 top
SC11  27,6 180 top
SC12  33,6 180 top
SC13  39,6 180 top
SC14  45,54 0 top
SC15  39,54 0 top
SC16  33,54 0 top
TP1  48,46 0 top
TP3  51.5,48.5 0 top
U1  29,46 0 top
U2  25,41.5 0 top
U3  21,46 0 top
U4  14,42 90 top
U5  18,38 90 top
U6  14,34 90 top
U7  18,30 90 top
U8  14,26 90 top
U9  18,22 90 top
U10  21,14 180 top
U11  25,18 180 top
U12  29,14 180 top
U13  33,18 180 top
U14  37,14 180 top
U15  41,41.5 0 top
U16  37,46 0 top
U17  33,41.5 0 top

### Tracks (layer width: path | path; a pad name or v marks a point on that pad's centre or on a via)
ADC  (via drill 0.3)
  Top 0.2: R1.1 R2.2 52.45,43.35 v53,42.8 | v32.1,38.5 31.75,38.15 MCU1.53
  Bottom 0.2: v53,42.8 53,35.3 52.3,34.6 47.9,34.6 46.6,35.9 46.6,36.8 45.8,37.6 33,37.6 v32.1,38.5
C1-N  (via drill 0.3)
  Top 0.2: U1.9 29,46.5 v28.6,46.1
  Bottom 0.2: SC1.N 27,53.6 30.6,50 30.6,46.5 30.2,46.1 v28.6,46.1
C1-N-SW
  Top 0.2: U1.8 29.6,46 28.7,45.1 28.7,43.7 29.6,42.8 29.6,41.4 29.2,41 29.2,39.7 30.25,38.65 MCU1.56
C1-P  (via drill 0.3)
  Top 0.2: v24.1,43.1 24.1,42.3 23.8,42 U2.2 | U1.3 v25.6,46 25.6,48.95 SC1.P
  Bottom 0.2: v24.1,43.1 25.6,44.6 v25.6,46
C1-P-SW
  Top 0.2: U1.4 27.9,45.5 28.3,45.1 28.3,43.5 29.2,42.6 29.2,41.6 28.8,41.2 28.8,39.5 29.75,38.55 MCU1.57
C2-N  (via drill 0.3)
  Top 0.2: U2.9 28.3,42 v28.5,42.2 | U1.7 30,45.5 29.6,45.1 v29.6,45
  Bottom 0.2: v28.5,42.2 29.6,43.3 v29.6,45 28.7,45 27.9,45.8 27.9,46.4 28.3,46.8 30,46.8 30.2,47 30.2,49.8 26.6,53.4 26.6,56.4 25.35,57.65 SC2.N
C2-N-SW
  Top 0.2: U2.8 28.1,41.5 28.4,41.2 28.4,37.5 28.75,37.15 MCU1.59
C2-P  (via drill 0.3)
  Top 0.2: U3.2 19.8,46.5 20.1,46.8 20.1,49.45 SC2.P | U1.10 29.7,47 v29.2,47.5 | U2.3 v24.5,41.5
  Bottom 0.2: SC2.P 21,49.1 21.9,48.2 25.3,48.2 25.7,48.6 27.1,48.6 27.5,48.2 27.5,47.6 | 27.5,47.6 27.6,47.5 v29.2,47.5 | v24.5,41.5 24.5,41.9 26.8,44.2 26.8,46.9 27.5,47.6
C2-P-SW
  Top 0.2: U2.4 23.9,41 24.3,40.6 24.3,38.9 24.7,38.5 26.8,38.5 28.25,37.05 MCU1.60
C3-N  (via drill 0.3)
  Top 0.2: v21.2,46.7 21.4,46.5 U3.9 24.1,46.5 24.4,46.2 24.4,45.1 25.3,44.2 25.3,41.9 26.2,41 U2.7
  Bottom 0.2: v21.2,46.7 21.7,46.2 24.7,46.2 25.1,46.6 25.1,47.4 24.7,47.8 21.7,47.8 20.3,49.2 18,49.2 17,50.2 17,51.7 15,53.7 SC3.N
C3-N-SW
  Top 0.2: U3.8 21.7,46 20.6,44.9 20.6,42.7 21.4,41.9 21.4,39 22.3,38.1 26.6,38.1 27.75,36.95 MCU1.61
C3-P
  Top 0.2: U4.2 13.5,40.9 13,41.4 12.2,41.4 11.7,41.9 11.7,47.05 SC3.P 16.5,48.85 16.5,46.5 17,46 U3.3 19.9,46 20.5,46.6 20.5,47.4 21.1,48 24.5,48 25.1,47.4 25.1,46.6 24.8,46.3 24.8,45.3 25.7,44.4 25.7,43.1 26.3,42.5 U2.10
C3-P-SW
  Top 0.2: U3.4 19.9,45.5 20.2,45.2 20.2,42.5 21,41.7 21,38.8 22.1,37.7 26.4,37.7 27.25,36.85 MCU1.62
C4-N  (via drill 0.3)
  Top 0.2: v13.1,42.6 13.5,43 U4.9 13.5,47.1 v14.3,47.9 | U3.7 21.9,45.5 21.6,45.2 v21.6,45
  Bottom 0.2: SC4.N 3.55,44.8 10.5,44.8 12,46.3 13,46.3 13.9,45.4 13.9,43.4 v13.1,42.6 | v21.6,45 21.6,45.3 20.5,46.4 20.5,47.8 19.9,48.4 14.8,48.4 v14.3,47.9
C4-N-SW
  Top 0.2: U4.8 14,42.8 14.9,41.9 15.8,41.9 16.6,42.7 17.9,42.7 18.4,42.2 19.9,42.2 20.6,41.5 20.6,36.3 23.15,33.75 MCU1.1
C4-P  (via drill 0.3)
  Top 0.2: SC4.P 11.3,44.35 11.3,40 12.7,38.6 v14,38.6 U4.3 | U5.2 17.5,36.9 v17.2,37.2 | v24.4,47 U3.10
  Bottom 0.2: v17.2,37.2 15.8,38.6 v14,38.6 | SC4.P 9.65,48.05 10.4,48.8 20.1,48.8 21.6,47.3 24.1,47.3 v24.4,47
C4-P-SW
  Top 0.2: U4.4 14.5,41.1 14.9,41.5 16,41.5 16.8,42.3 17.7,42.3 18.2,41.8 19.7,41.8 20.2,41.3 20.2,36.1 23.05,33.25 MCU1.2
C5-N  (via drill 0.3)
  Top 0.2: U4.7 14.5,43.1 15,42.6 v15.3,42.6 | v17.2,41.6 17.5,41.3 U5.9
  Bottom 0.2: SC5.N 2.35,43.65 3.1,44.4 10.7,44.4 12.2,45.9 12.8,45.9 13.5,45.2 13.5,44.5 12.1,43.1 12.1,42.1 12.4,41.8 14.5,41.8 v15.3,42.6 16.2,42.6 v17.2,41.6
C5-N-SW
  Top 0.2: U5.8 18,41.2 18.2,41.4 19.5,41.4 19.8,41.1 19.8,35.9 22.95,32.75 MCU1.3
C5-P  (via drill 0.3)
  Top 0.2: SC5.P 11.7,37.95 11.7,34 12.2,33.5 12.8,33.5 13.5,32.8 U6.2 | U5.3 v18,37.6 | v12.4,45.1 12.8,45.1 13,44.9 U4.10
  Bottom 0.2: v18,37.6 18,37 17.5,36.5 16.9,36.5 16.4,37 16.4,37.4 15.6,38.2 14.7,38.2 14.4,37.9 13.5,37.9 11.4,40 | SC5.P 11.4,40 | 11.4,40 11.4,43.7 12.4,44.7 v12.4,45.1
C5-P-SW
  Top 0.2: U5.4 18.5,34.85 18.75,34.6 20.5,34.6 22.85,32.25 MCU1.4
C6-N  (via drill 0.3)
  Top 0.2: v14.1,33.9 14.1,34.1 13.5,34.7 U6.9 13.5,37.3 13.7,37.5 16.3,37.5 17.3,38.5 18.1,38.5 18.5,38.9 U5.7
  Bottom 0.2: v14.1,33.9 14.1,35 12.6,36.5 8.55,36.5 6.05,34 SC6.N
C6-N-SW
  Top 0.2: U6.8 14,35.1 15,34.1 15.6,34.1 16.2,34.7 17.7,34.7 18.2,34.2 20.3,34.2 22.75,31.75 MCU1.5
C6-P  (via drill 0.3)
  Top 0.2: v17.1,29.3 17.5,28.9 U7.2 | SC6.P 12.3,31.35 12.3,30.7 12.5,30.5 v14,30.5 U6.3 14,32.9 13,33.9 12.4,33.9 12.1,34.2 12.1,37.1 12.9,37.9 16.1,37.9 17,38.8 U5.10
  Bottom 0.2: v14,30.5 15.9,30.5 v17.1,29.3
C6-P-SW
  Top 0.2: U6.4 14.5,33.4 14.8,33.7 15.8,33.7 16.4,34.3 17.5,34.3 18,33.8 20.1,33.8 22.65,31.25 MCU1.6
C7-N  (via drill 0.3)
  Top 0.2: U6.7 14.5,35.2 14.9,34.8 v15.3,34.8 | v17.3,33.5 17.5,33.3 U7.9
  Bottom 0.2: 15.3,34.1 16.7,34.1 v17.3,33.5 | SC7.N 2.35,32.45 3.5,33.6 6.3,33.6 8.8,36.1 12.4,36.1 13.5,35 13.5,34.4 13.3,34.2 13.3,33.7 13.8,33.2 14.4,33.2 15.3,34.1 | 15.3,34.1 v15.3,34.8
C7-N-SW
  Top 0.2: U7.8 18,33.1 18.3,33.4 19.9,33.4 20.4,32.9 20.4,30.1 21.75,28.75 MCU1.11
C7-P  (via drill 0.3)
  Top 0.2: U8.2 13.5,24.9 13.4,25 12.4,25 11.9,25.5 11.9,27.3 11.2,28 SC7.P | v18,29.3 U7.3 | U6.10 13,34.95 12.8,34.75 v12.8,34.7
  Bottom 0.2: v18,29.3 18,31.6 17.3,32.3 13,32.3 12.5,31.8 11.3,31.8 | 11.3,31.8 11.3,29.65 SC7.P | v12.8,34.7 12.8,34.6 11.3,33.1 11.3,31.8
C7-P-SW
  Top 0.2: U7.4 18.5,28.8 19.3,29.6 20.3,29.6 21.65,28.25 MCU1.12
C8-N  (via drill 0.3)
  Top 0.2: v14.1,25.9 14.1,26.2 13.5,26.8 U8.9 13.5,29.1 13.8,29.4 16.2,29.4 17.3,30.5 18.2,30.5 18.5,30.8 U7.7
  Bottom 0.2: SC8.N 7.2,22 12,26.8 13.5,26.8 14.1,26.2 v14.1,25.9
C8-N-SW
  Top 0.2: U8.8 14,27 15.1,25.9 15.9,25.9 16.6,26.6 20.5,26.6 21.65,27.75 MCU1.13
C8-P  (via drill 0.3)
  Top 0.2: v14,22.6 U8.3 14,25 13.6,25.4 12.6,25.4 12.3,25.7 12.3,29.1 13,29.8 16,29.8 17,30.8 U7.10 | U9.2 17.5,20.9 v17.1,21.3
  Bottom 0.2: SC8.P 11.35,23.7 13.7,23.7 14,23.4 | 14,23.4 v14,22.6 | v17.1,21.3 16.5,21.9 16.5,22.6 15.4,23.7 14.3,23.7 14,23.4
C8-P-SW
  Top 0.2: U8.4 14.5,25 15,25.5 16.1,25.5 16.8,26.2 20.7,26.2 21.75,27.25 MCU1.14
C9-N  (via drill 0.3)
  Top 0.2: v17.2,25.5 17.5,25.2 U9.9 | U8.7 14.5,27.1 14.9,26.7 v15.4,26.7
  Bottom 0.2: SC9.N 13.1,4.25 13.1,13.3 17.3,17.5 17.3,18.9 18.4,20 18.4,22.3 17.2,23.5 v17.2,25.5 15.6,25.5 15.4,25.7 v15.4,26.7
C9-N-SW
  Top 0.2: U9.8 18,25.3 18.5,25.8 20.9,25.8 21.85,26.75 MCU1.15
C9-P  (via drill 0.3)
  Top 0.2: SC9.P 17.25,11.9 20.9,11.9 21.9,12.9 21.9,13.3 22.1,13.5 U10.2 | v18,18.6 U9.3 18,21.7 v17.6,22.1 | v13,26.1 U8.10
  Bottom 0.2: SC9.P 15.8,10.45 15.8,15.3 18,17.5 v18,18.6 | v17.6,22.1 15.6,24.1 11.3,24.1 10.9,24.5 10.9,25.1 11.9,26.1 v13,26.1
C9-P-SW
  Top 0.2: U9.4 18.5,21.6 20.7,23.8 20.7,25 21.95,26.25 MCU1.16
C10-N  (via drill 0.3)
  Top 0.2: U10.9 17.75,13.5 17.35,13.1 v17.3,13.1 16.1,13.1 15.8,13.4 15.8,21.5 17.3,23 18.3,23 18.5,23.2 U9.7
  Bottom 0.2: SC10.N 21,6.4 18.1,9.3 18.1,12.6 17.6,13.1 v17.3,13.1
C10-N-SW
  Top 0.2: U10.8 20.1,14 21.1,15 21.1,16.3 20.5,16.9 20.5,19.7 22.1,21.3 25.8,21.3 26.25,21.75 MCU1.17
C10-P  (via drill 0.3)
  Top 0.2: U11.2 26.2,17.5 25.7,17 v25.4,17 | SC10.P 23.75,9.65 24.6,10.5 24.6,13.8 v24.4,14 U10.3 22,14 21.5,13.5 21.5,13.1 20.7,12.3 16.3,12.3 15.4,13.2 15.4,21.7 17,23.3 U9.10
  Bottom 0.2: v25.4,17 24.4,16 v24.4,14
C10-P-SW
  Top 0.2: U10.4 22,14.5 21.5,15 21.5,16.5 20.9,17.1 20.9,19.5 22.3,20.9 26,20.9 26.75,21.65 MCU1.18
C11-N  (via drill 0.3)
  Top 0.2: U11.9 v21.5,17.5 | v20.4,15.3 20.4,14.9 20,14.5 U10.7
  Bottom 0.2: v21.5,17.5 20.4,16.4 v20.4,15.3 18.5,13.4 18.5,9.5 21.4,6.6 21.4,3.5 22.55,2.35 SC11.N
C11-N-SW
  Top 0.2: U11.8 21.9,18 21.6,18.3 21.6,19.6 22.5,20.5 26.2,20.5 27.25,21.55 MCU1.19
C11-P  (via drill 0.3)
  Top 0.2: U12.2 30.07,13.5 29.7,13.13 29.7,12.5 27,9.8 SC11.P | v20.2,13 U10.10 | v25.4,18 U11.3
  Bottom 0.2: SC11.P 25.2,9.65 23.15,11.7 | 23.15,11.7 21.5,11.7 v20.2,13 | v25.4,18 23.15,15.75 23.15,11.7
C11-P-SW
  Top 0.2: U11.4 26.1,18.5 25.8,18.8 25.8,19.5 27.75,21.45 MCU1.20
C12-N  (via drill 0.3)
  Top 0.2: v29.3,14.3 28.8,14.3 28,13.5 U12.9 26,13.5 25.7,13.8 25.7,15.7 24.5,16.9 24.5,18.1 24.1,18.5 U11.7
  Bottom 0.2: v29.3,14.3 28.2,14.3 27.5,13.6 27.5,12 33,6.5 SC12.N
C12-N-SW
  Top 0.2: U12.8 27.9,14 29.1,15.2 29.1,16.3 28.4,17 28.4,18.1 28.8,18.5 28.8,20.9 28.25,21.45 MCU1.21
C12-P  (via drill 0.3)
  Top 0.2: U11.10 23.8,17 25.3,15.5 25.3,13 26.1,12.2 28.8,12.2 29.3,12.7 29.3,13.3 30,14 U12.3 v32.4,14 32.9,13.5 32.9,9.75 SC12.P | U13.2 34.2,17.5 33.6,16.9 v33.4,16.9
  Bottom 0.2: v32.4,14 32.4,15.9 v33.4,16.9
C12-P-SW
  Top 0.2: U12.4 30.3,14.5 29.5,15.3 29.5,16.5 28.8,17.2 28.8,17.9 29.2,18.3 29.2,21.1 28.75,21.55 MCU1.22
C13-N  (via drill 0.3)
  Top 0.2: U12.7 27.8,14.5 28.3,15 v28.3,15.3 | v29.5,17.5 U13.9
  Bottom 0.2: 28.8,15.8 29.5,16.5 v29.5,17.5 | 28.8,15.8 v28.3,15.3 | SC13.N 34.55,2.35 33.4,3.5 33.4,6.7 27.9,12.2 27.9,13.4 28.1,13.6 29.5,13.6 30,14.1 30,14.6 28.8,15.8
C13-N-SW
  Top 0.2: U13.8 29.9,18 29.6,18.3 29.6,21.3 29.25,21.65 MCU1.23
C13-P  (via drill 0.3)
  Top 0.2: U14.2 38.1,13.5 37.8,13.2 37.8,10.85 SC13.P | v28.6,12.9 28.5,13 U12.10 | v33.4,18 U13.3
  Bottom 0.2: SC13.P 36.6,9.65 33.95,12.3 31.8,12.3 | v33.4,18 32,16.6 32,15 31.5,14.5 31.5,12.6 31.8,12.3 | v28.6,12.9 28.6,12.7 29.8,11.5 31,11.5 31.8,12.3
C13-P-SW
  Top 0.2: U13.4 34,18.5 32.1,20.4 31.2,20.4 29.75,21.85 MCU1.24
C14-N  (via drill 0.3)
  Top 0.2: v37.3,14.3 36.8,14.3 36,13.5 U14.9 33.9,13.5 33.7,13.7 33.7,15.7 32.5,16.9 32.5,18 32,18.5 U13.7 | v41.4,17.9 42.1,17.9 43.7,19.5 50.1,19.5 52,21.4 52,32.8 49.5,35.3 v49.2,35.3
  Bottom 0.2: v37.3,14.3 37.7,14.3 41.3,17.9 v41.4,17.9 | SC14.N 45,53.8 50.2,48.6 50.2,35.5 50,35.3 v49.2,35.3
C14-N-SW
  Top 0.2: MCU1.25 30.25,21.95 31.4,20.8 35.03,20.8 37.1,18.73 37.1,15.2 35.9,14 U14.8
C14-P  (via drill 0.3)
  Top 0.2: U13.10 31.8,17 33.3,15.5 33.3,12.9 33.9,12.3 37,12.3 37.4,12.7 37.4,13.4 38,14 U14.3 40.6,14 41,14.4 41,15.6 44.1,18.7 50.5,18.7 52.8,21 52.8,33.2 49.5,36.5 v49.5,37 | U15.2 39.8,42 40.1,42.3 v40.1,43.2 | v42.2,43.3 42.6,43.7 44.5,43.7 46,45.2 46,46.9 45,47.9 SC14.P
  Bottom 0.2: v40.1,43.2 40.6,42.7 41.6,42.7 v42.2,43.3 | v49.5,37 49.8,37.3 49.8,48.4 47.85,50.35 SC14.P
C14-P-SW
  Top 0.2: MCU1.26 30.75,22.05 31.6,21.2 35.2,21.2 37.5,18.9 37.5,15.1 38.1,14.5 U14.4
C15-N  (via drill 0.3)
  Top 0.2: U14.7 35.8,14.5 36.3,15 v36.3,15.3 | v40.6,18.4 41,18.8 42.4,18.8 43.5,19.9 49.9,19.9 51.6,21.6 51.6,32.5 49.5,34.6 49,34.6 47.4,36.2 v47.4,36.4 | U15.9 v44.5,42
  Bottom 0.2: v36.3,15.3 38.1,15.3 40.6,17.8 v40.6,18.4 | v44.5,42 45.4,42 47.4,40 v47.4,36.4 47.5,36.3 48.5,36.3 48.8,36.6 48.8,37.1 49.4,37.7 49.4,48.2 48.4,49.2 44.2,49.2 43.8,49.6 43.8,51.6 44.6,52.4 44.6,56.5 43.45,57.65 SC15.N
C15-N-SW
  Top 0.2: U15.8 44.1,41.5 44.3,41.3 44.3,39.7 43.5,38.9 40.4,38.9 39.9,39.4 37.9,39.4 36.5,38 36.5,34 36.25,33.75 MCU1.48
C15-P  (via drill 0.3)
  Top 0.2: v36.6,13 U14.10 | v41.4,17 41.8,17 43.9,19.1 50.3,19.1 52.4,21.2 52.4,33 49.4,36 48.5,36 48.1,36.4 v48.1,37 | U16.2 36.2,46.5 36.4,46.7 36.4,47.7 37.1,48.4 38.5,48.4 39,48.9 SC15.P | v40.3,41.5 U15.3
  Bottom 0.2: v36.6,13 37,13 41,17 v41.4,17 | SC15.P 43.5,45.85 43.5,42.9 | v40.3,41.5 40.7,41.9 42.9,41.9 43.5,42.5 43.5,42.9 | v48.1,37 47.8,37.3 47.8,40.2 45.1,42.9 43.5,42.9
C15-P-SW
  Top 0.2: U15.4 39.8,41 40.1,40.7 40.1,40 39.9,39.8 37.7,39.8 36,38.1 34.6,38.1 33.75,37.25 MCU1.49
C16-N  (via drill 0.3)
  Top 0.2: v37.6,46.8 37.9,46.5 U16.9 40.3,46.5 41.1,45.7 41.1,42.7 41.5,42.3 41.5,41.3 41.8,41 U15.7
  Bottom 0.2: v37.6,46.8 35.1,49.3 35.1,52.2 33,54.3 SC16.N
C16-N-SW
  Top 0.2: U16.8 37.6,46 36.8,45.2 36.8,39.5 35.8,38.5 34.4,38.5 33.25,37.35 MCU1.50
C16-P
  Top 0.2: SC16.P 33.6,49.75 33.6,46.4 34,46 U16.3 36.3,46 36.8,46.5 36.8,47.5 37.3,48 44.3,48 45.6,46.7 45.6,45.4 44.3,44.1 41.9,44.1 41.5,43.7 41.5,42.9 41.9,42.5 U15.10
C16-P-SW
  Top 0.2: U16.4 35.9,45.5 36.4,45 36.4,39.7 35.6,38.9 34.2,38.9 32.75,37.45 MCU1.51
GND  (via drill 0.3)
  Top 0.2: RTC1.EP v42.6,31.5 | v42.6,32.3 42.75,32.45 RTC1.3 42.75,33.95 42.8,34 | v43.4,32.3 43.25,32.45 RTC1.2 43.25,33.95 43.3,34 | RTC1.9 42.25,31.15 v42.6,31.5 | RTC1.10 42.75,31.35 v42.6,31.5
  other vias: 39.2,44.3 43.2,39.8 35.2,39.8 31.2,44.3 27.2,39.8 23.2,44.3 15.7,44.2 19.1,38.4 15.7,36.2 19.7,32.2 15.7,28.2 19.7,24.2 22.8,19.7 18.8,15.7 26.8,15.7 34.8,15.7 30.8,19.7 43.4,31.5 45,34.6 38.1,21.2 40,21.2 37.2,25 40.8,26.4 21.7,22.7 23.3,24.1 22.8,30 37.9,45.2 38.4,44.3 40,44.3 40.4,45.2 44,47.2 44.9,46 47,47.9 37.3,36.5 44.3,36.5 49.4,32.9 49.7,26.3 54,29 52.1,35.7 12,49.7 9.8,49.6 15.7,47.6 21.5,36.8 35.6,36 32.4,22 45.3,40.4 46.5,37.9 39.6,36.2 35.9,49.5 42,49.5 24,49.5 10.5,42.9 10.9,37.2 10.6,31 18.1,1.1 24,1.1 30,1.1 36,1.1 36.3,11.4 40.8,30.3
  pour Bottom (isolate 0.254, rank 6): 0,0 72,0 72,60 0,60
  pour Top (isolate 0.254, rank 6): 72,0 0,0 0,60 72,60
ICSPCLK  (via drill 0.3)
  Top 0.2: MCU1.42 36.75,30.75 37.6,29.9 v38.2,29.9
  Bottom 0.2: v38.2,29.9 38.2,27.3 40,25.5 44.2,25.5 46.66,23.04 J2.5
ICSPDAT  (via drill 0.3)
  Top 0.2: MCU1.37 37.05,28.25 v37.4,27.9
  Bottom 0.2: v37.4,27.9 37.4,27.5 39.8,25.1 42.02,25.1 J2.4
LOAD-CTRL  (via drill 0.3)
  Top 0.2: Q2.1 47.35,37.55 46.4,36.6 v45.6,36.6 | v29.1,38.1 29.25,37.95 MCU1.58
  Bottom 0.2: v45.6,36.6 45,37.2 39.2,37.2 36.7,34.7 32.5,34.7 v29.1,38.1
LOAD-S
  Top 0.2: R7.1 Q2.3
MCLR  (via drill 0.3)
  Top 0.2: MCU1.7 22.55,30.75 21.8,31.5 v21.2,31.5
  Bottom 0.2: v21.2,31.5 22,30.7 22,24 23,23 J2.1
Q1-D
  Top 0.2: R2.1 Q1.3
RTC-AF
  Top 0.2: RTC1.14 46.4,31.65 C6.1
RTC-INT1  (via drill 0.3)
  Top 0.2: RTC1.11 R3.2 v42.1,28.5 | MCU1.44 37.35,31.75 v37.6,31.5
  Bottom 0.2: v42.1,28.5 41.9,28.7 40.4,28.7 40,29.1 40,30.9 39.1,31.8 37.9,31.8 v37.6,31.5
RTC-INT2  (via drill 0.3)
  Top 0.2: R4.2 42.25,34.9 42.25,33.9 | 42.25,33.9 RTC1.4 | v38.2,30.8 37.3,30.8 36.85,31.25 MCU1.43 | 42.25,33.9 v41.1,33.9
  Bottom 0.2: v41.1,33.9 41.1,32.9 40.4,32.2 37.3,32.2 36.9,31.8 36.9,31.2 37.3,30.8 v38.2,30.8
RTC-SCL
  Top 0.2: MCU1.45 37.85,32.25 38.95,31.15 R6.2 39.95,31.15 40.45,31.65 RTC1.7
RTC-SDA
  Top 0.2: MCU1.46 38.05,32.75 38.3,32.5 39.25,32.5 R5.2 39.75,32.5 40.1,32.5 40.45,32.15 RTC1.6
RTC-VBAT
  Top 0.2: RTC1.5 40.75,32.65 40.5,32.9 40.5,37.15 R8.2 R9.1
RX5  (via drill 0.3)
  Top 0.2: MCU1.63 26.75,36.75 26.2,37.3 24.7,37.3 v24.3,36.9 | v11.5,48.1 11.2,48.4 11.2,51.6 14.7,55.1 55.9,55.1 56.54,55.74 J5.2
  Bottom 0.2: v24.3,36.9 24.3,37.8 15,47.1 12.3,47.1 11.5,47.9 v11.5,48.1
SW-GND  (via drill 0.3)
  Top 0.2: MCU1.52 32.25,37.55 33.4,38.7 v33.4,39.1 | Q1.1 49.92,39.5 46.8,39.5 v45.8,38.5
  Bottom 0.2: v45.8,38.5 45.3,38 34.5,38 v33.4,39.1
TX5  (via drill 0.3)
  Top 0.2: MCU1.64 26.25,36.65 26,36.9 25.2,36.9 v24.3,36 | v10.8,47.4 10.8,51.8 14.5,55.5 53.4,55.5 54,56.1 J5.1
  Bottom 0.2: v24.3,36 23.6,36.7 23.6,37.9 14.8,46.7 11.5,46.7 v10.8,47.4
V-ARY  (via drill 0.3)
  Top 0.2: R1.2 TP3.P$1 v51.5,50.6 | U17.3 v32.5,41.5 33,42 | U1.2 27.85,46.5 28.3,46.95 28.3,47.6 28.9,48.2 31,48.2 v31.3,47.9 | U17.9 33,42 | 33,42 32.8,42.2 32.8,48 31.2,49.6 31.2,51.6 32.4,52.8 48.5,52.8 v48.8,53.1
  Bottom 0.2: v31.3,47.9 31.3,45.6 32.5,44.4 v32.5,41.5 | v48.8,53.1 50.5,53.1 51.5,52.1 v51.5,50.6
V-EH  (via drill 0.3)
  Top 0.2: U17.10 33.7,42.5 33.2,43 33.2,48.2 31.6,49.8 31.6,51.4 32.6,52.4 48.5,52.4 v48.8,52.1 | v50.4,52.1 53.5,52.1 54.2,51.4 54.2,41.4 58.6,37 J4.2
  Bottom 0.2: v48.8,52.1 v50.4,52.1
V-SYS
  Top 0.2: R9.2 43.6,37.5 46.3,40.2 46.3,43.6 46.6,43.9 47.95,43.9 R7.2 TP1.P$1 49.6,47.6 49.6,53.3 | U17.2 31.9,42 32.4,42.5 32.4,47.8 30.8,49.4 30.8,51.8 32.2,53.2 47.9,53.2 48.5,53.8 49.1,53.8 49.6,53.3 | J3.2 63.9,50 62.9,51 62.9,53.1 62.2,53.8 50.1,53.8 49.6,53.3
VDD-BKP  (via drill 0.3)
  Top 0.2: R6.1 39.55,29.4 | 39.55,29.4 v40.7,29.4 | v38.4,34.6 38.55,34.45 R5.1 | R4.1 v44.4,35.5 47.5,35.5 48.3,34.7 48.3,30.2 47.9,29.8 46.95,29.8 C5.1 46.85,29.8 v45.6,29.8 | v45.6,29.8 45.6,30.7 45.15,31.15 RTC1.13 | R3.1 45.6,29.15 v45.6,29.8 | MCU1.38 37.8,28.75 C1.2 | C1.2 39.55,28.8 39.55,29.4 | C1.2 38.65,23.39 J2.2 | U14.1 v40.5,13 | C4.2 42.15,14.65 v40.5,13 | U13.1 v36.3,17 | v32.2,13 U12.1 30.6,13 30.4,12.8 v30.4,12.2 | U11.1 27.7,17 28.1,16.6 v28.1,16.3 | v23.9,12.3 23.9,12.9 23.8,13 U10.1 22.6,13 21.1,11.5 17.5,11.5 16.3,10.3 16.3,8.9 15.8,8.4 14.2,8.4 13.7,8.9 13.7,10.7 15,12 15,20 14.15,20.85 C3.2 13,21.85 v13,21.9 U8.1 13,24.4 12.8,24.6 11.8,24.6 v11.6,24.8 | U9.1 17,19 v16.6,18.6 | v16.2,27.4 16.85,27.4 17,27.55 U7.1 | U5.1 17,35.5 16.8,35.3 v16.3,35.3 | v12.1,32.6 12.75,32.6 13,32.35 U6.1 | MCU1.10 21.85,29.25 21.2,29.9 v21.2,30.4 | U4.1 13,40.4 12.8,40.6 v12.4,40.6 | U3.1 v17.7,47 | U2.1 22.25,42.5 22.1,42.65 v22.1,43.1 | U1.1 26.4,47.45 v26.4,47.8 | U17.1 30.6,42.5 30.3,42.8 v30.3,43.1 | U16.1 34.5,47 34.4,47.1 v34.4,47.6 | C2.2 42.7,45.45 v42.7,44.9 | v38.1,43.1 38.1,42.8 38.4,42.5 U15.1 | BAT1.P 59.68,2 J1.2 48.04,5.46 v40.5,13
  Bottom 0.2: v44.4,35.5 38.8,35.5 38.4,35.1 v38.4,34.6 | v40.7,29.4 45.2,29.4 v45.6,29.8 | 35.6,13 36.2,12.4 39.9,12.4 v40.5,13 | 35.6,13 35.6,15.6 36.3,16.3 v36.3,17 39.04,19.74 J2.2 | v32.2,13 35.6,13 | v23.9,12.3 26.7,12.3 27.1,12.7 27.1,15.1 28.1,16.1 v28.1,16.3 28.3,16.3 28.8,16.8 28.8,17.7 29.2,18.1 29.8,18.1 30.2,17.7 30.2,17.3 30,17.1 30,15.17 30.4,14.77 v30.4,12.2 | v13,21.9 13.2,21.7 15.5,21.7 16.6,20.6 v16.6,18.6 | v11.6,24.8 11.9,25.1 14.4,25.1 14.8,25.5 14.8,26.2 14.6,26.4 14.6,27 15,27.4 v16.2,27.4 20.4,27.4 21.2,28.2 v21.2,30.4 20.5,31.1 19.2,31.1 17.6,32.7 | 17.6,32.7 18.1,33.2 18.1,33.7 16.8,35 | v16.3,35.3 16.5,35.3 16.8,35 | 17.6,32.7 12.2,32.7 v12.1,32.6 | v12.4,40.6 12.4,39.6 12.7,39.3 15.8,39.3 16.8,38.3 18.2,38.3 18.7,37.8 18.7,36.9 | 18.7,36.9 16.8,35 | v17.7,47 17.7,46 20.6,43.1 v22.1,43.1 22.9,42.3 23.6,42.3 | v26.4,47.8 26.4,44.4 24.3,42.3 23.6,42.3 | v30.3,43.1 28,40.8 | 28,40.8 26.1,40.8 | 26.1,40.8 23.9,40.8 23.6,41.1 23.6,42.3 | v34.4,47.6 34.4,43.1 | 34.4,43.1 34.4,41.3 33.2,40.1 28.7,40.1 28,40.8 | v42.7,44.9 42.7,44.4 43.1,44 43.1,42.7 42.7,42.3 38.6,42.3 38.1,42.8 v38.1,43.1 34.4,43.1 | 18.7,36.9 21.2,34.4 25.5,34.4 26.1,35 26.1,40.8
VEH-SW
  Top 0.2: U17.8 33.7,41.5 32.5,40.3 32.5,39.9 31.25,38.65 MCU1.54
VSYS-SW
  Top 0.2: U17.4 31.8,41 32.1,40.7 32.1,40.1 30.75,38.75 MCU1.55

### Text on the board
tPlace: TX | RX | GND | VSYS | EH | VDD-BKP
tNames: v1.2 | Software / Defined / Energy